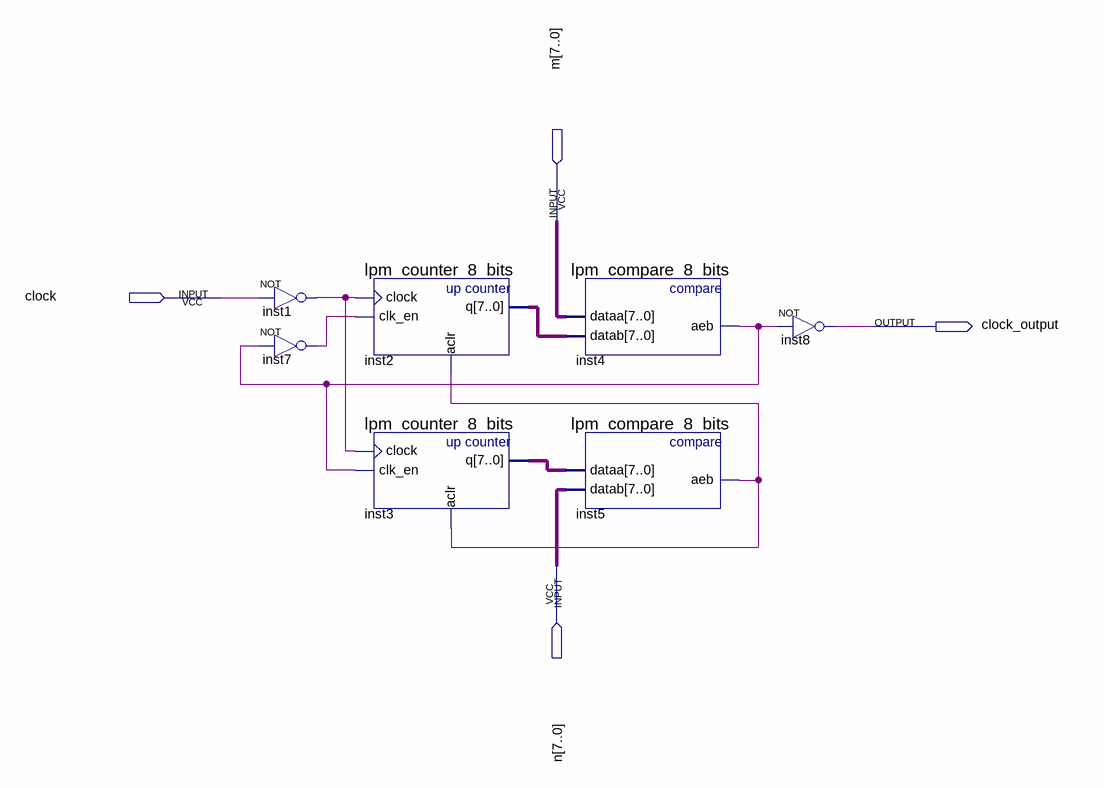
[diagram p0: schematic sheet]
// Quartus schematic BlockA.bdf as structural Verilog: 7 symbols, 4 pins
module BlockA (
  input  [7:0] m,
  input  clock,
  input  [7:0] n,
  output clock_output
);

  wire inst1_out, inst4_aeb, inst5_aeb, inst7_out;
  wire [7:0] inst2_q, inst3_q;

  not inst1 (inst1_out, clock);
  not inst7 (inst7_out, inst4_aeb);
  lpm_counter_8_bits inst2 (.clock(inst1_out), .clk_en(inst7_out), .aclr(inst5_aeb), .q(inst2_q));
  lpm_counter_8_bits inst3 (.clock(inst1_out), .clk_en(inst4_aeb), .aclr(inst5_aeb), .q(inst3_q));
  lpm_compare_8_bits inst4 (.dataa(m), .datab(inst2_q), .aeb(inst4_aeb));
  lpm_compare_8_bits inst5 (.dataa(inst3_q), .datab(n), .aeb(inst5_aeb));
  not inst8 (clock_output, inst4_aeb);
endmodule
